# EAGLE design esquematico (EAGLE 9.6.2)
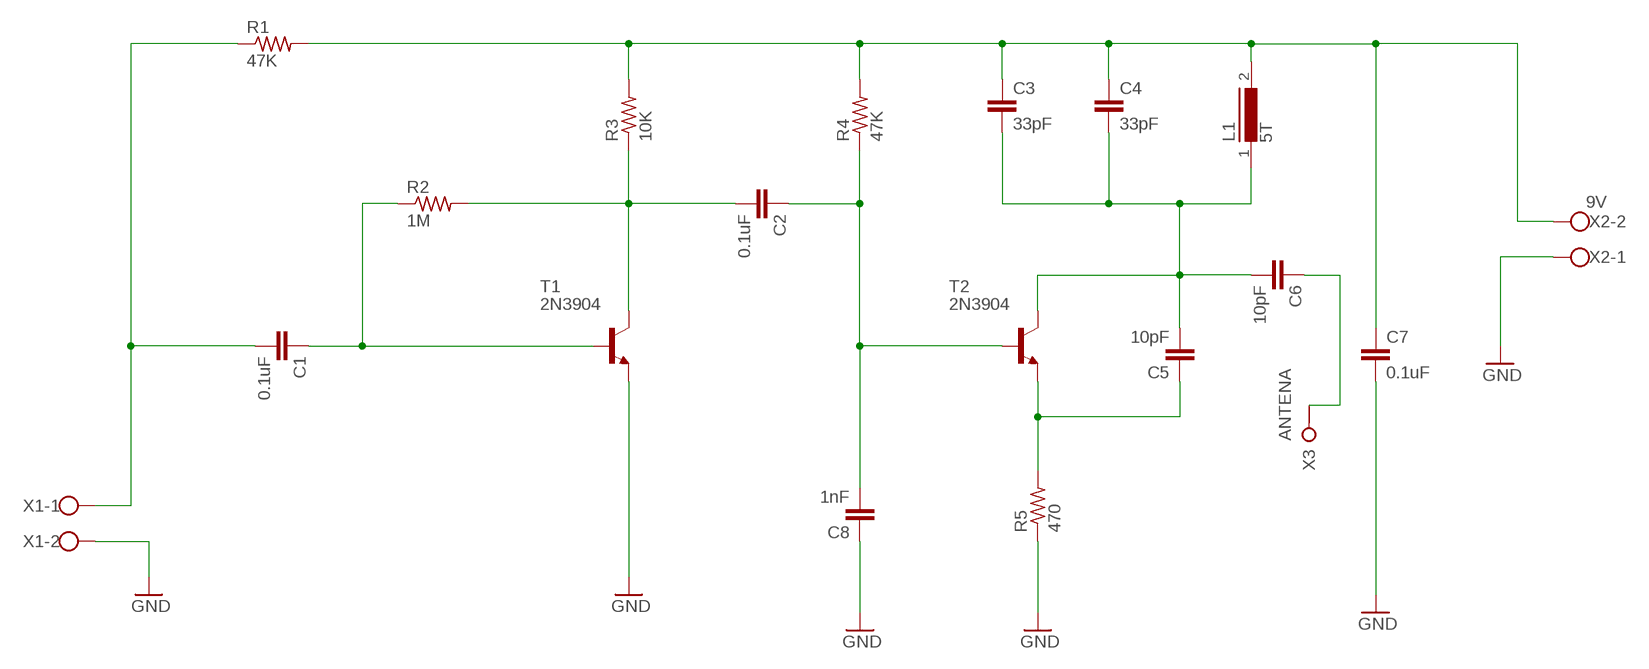
[diagram p0: schematic, sheet 1]

## Parts
C1  0.1uF  C-EU025-025X050  [C025-025X050]
C2  0.1uF  C-EU025-025X050  [C025-025X050]
C3  33pF  C-EU025-025X050  [C025-025X050]
C4  33pF  C-EU025-025X050  [C025-025X050]
C5  10pF  C-EU025-025X050  [C025-025X050]
C6  10pF  C-EU025-025X050  [C025-025X050]
C7  0.1uF  C-EU025-025X050  [C025-025X050]
C8  1nF  C-EU025-025X050  [C025-025X050]
L1  5T  A26GFC  [A26GFC]
R1  47K  R-US_0207/10  [0207/10]
R2  1M  R-US_0207/10  [0207/10]
R3  10K  R-US_0207/10  [0207/10]
R4  47K  R-US_0207/10  [0207/10]
R5  470  R-US_0207/10  [0207/10]
T1  2N3904  [TO92]
T2  2N3904  [TO92]
X1  W237-102  [W237-102]
X2  9V  W237-102  [W237-102]
X3  ANTENA  W236-1  [W236-1]

## Nets
GND: C7.2 C8.1 R5.1 T1.3(E) X1.2 X2.1
N$1: C1.2 R1.1 X1.1
N$2: C1.1 R2.1 T1.2(B)
N$3: C2.2 R2.2 R3.1 T1.1(C)
N$4: C3.1 C4.1 C7.1 L1.2 R1.2 R3.2 R4.2 X2.2
N$5: C2.1 C8.2 R4.1 T2.2(B)
N$6: C5.1 R5.2 T2.3(E)
N$7: C3.2 C4.2 C5.2 C6.2 L1.1 T2.1(C)
N$8: C6.1 X3.1(KL1)
Unconnected: X3.2(KL2)

## Library data of the parts
C1-C8 = rcl:C-EU: CAPACITOR, European symbol; SPICEPREFIX: C
L1 = inductors:A26GFC: INDUCTOR; SPICEPREFIX: L
R1-R5 = rcl:R-US_: RESISTOR, American symbol; SPICEPREFIX: R
T1 T2 = transistor:2N3904: NPN TRANSISTOR
X1 X2 = con-wago-500:W237-102: WAGO SCREW CLAMP; MPN: 237-102; OC_FARNELL: unknown; OC_NEWARK: 70K9898
X3 = con-wago-508:W236-1: WAGO SREW CLAMP; OC_FARNELL: unknown; OC_NEWARK: unknown

## Board
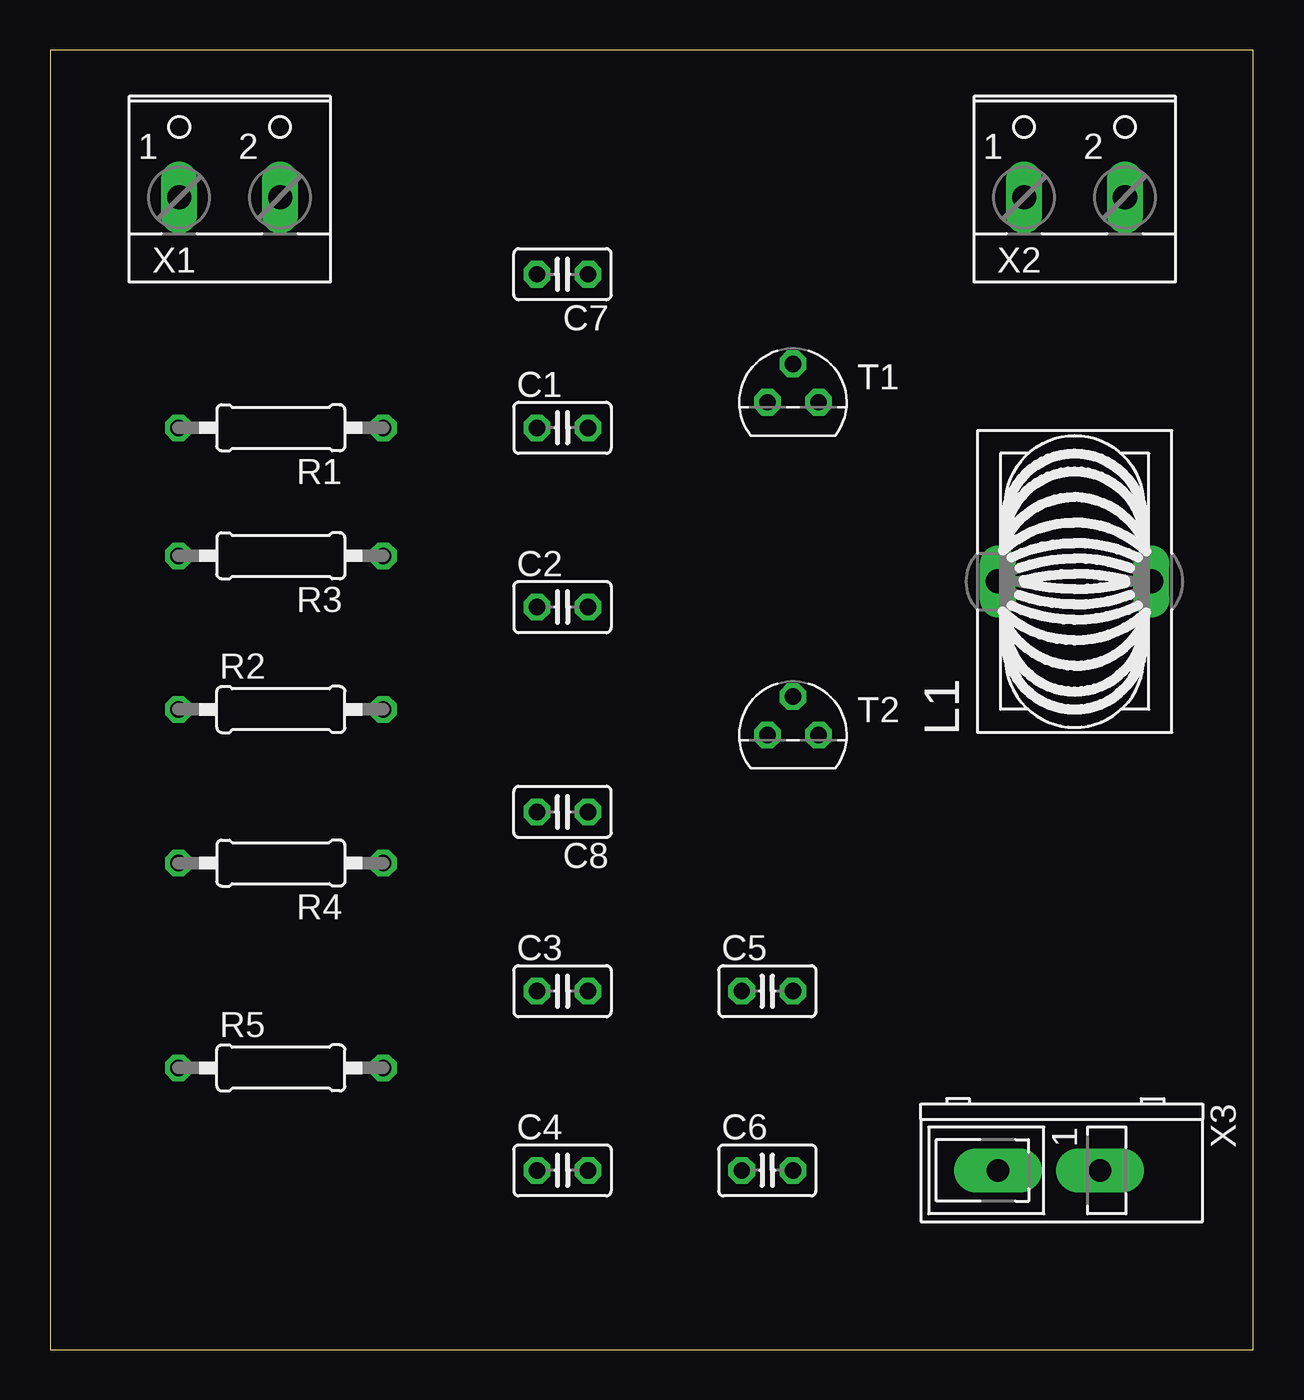
[diagram p1: board, top side]
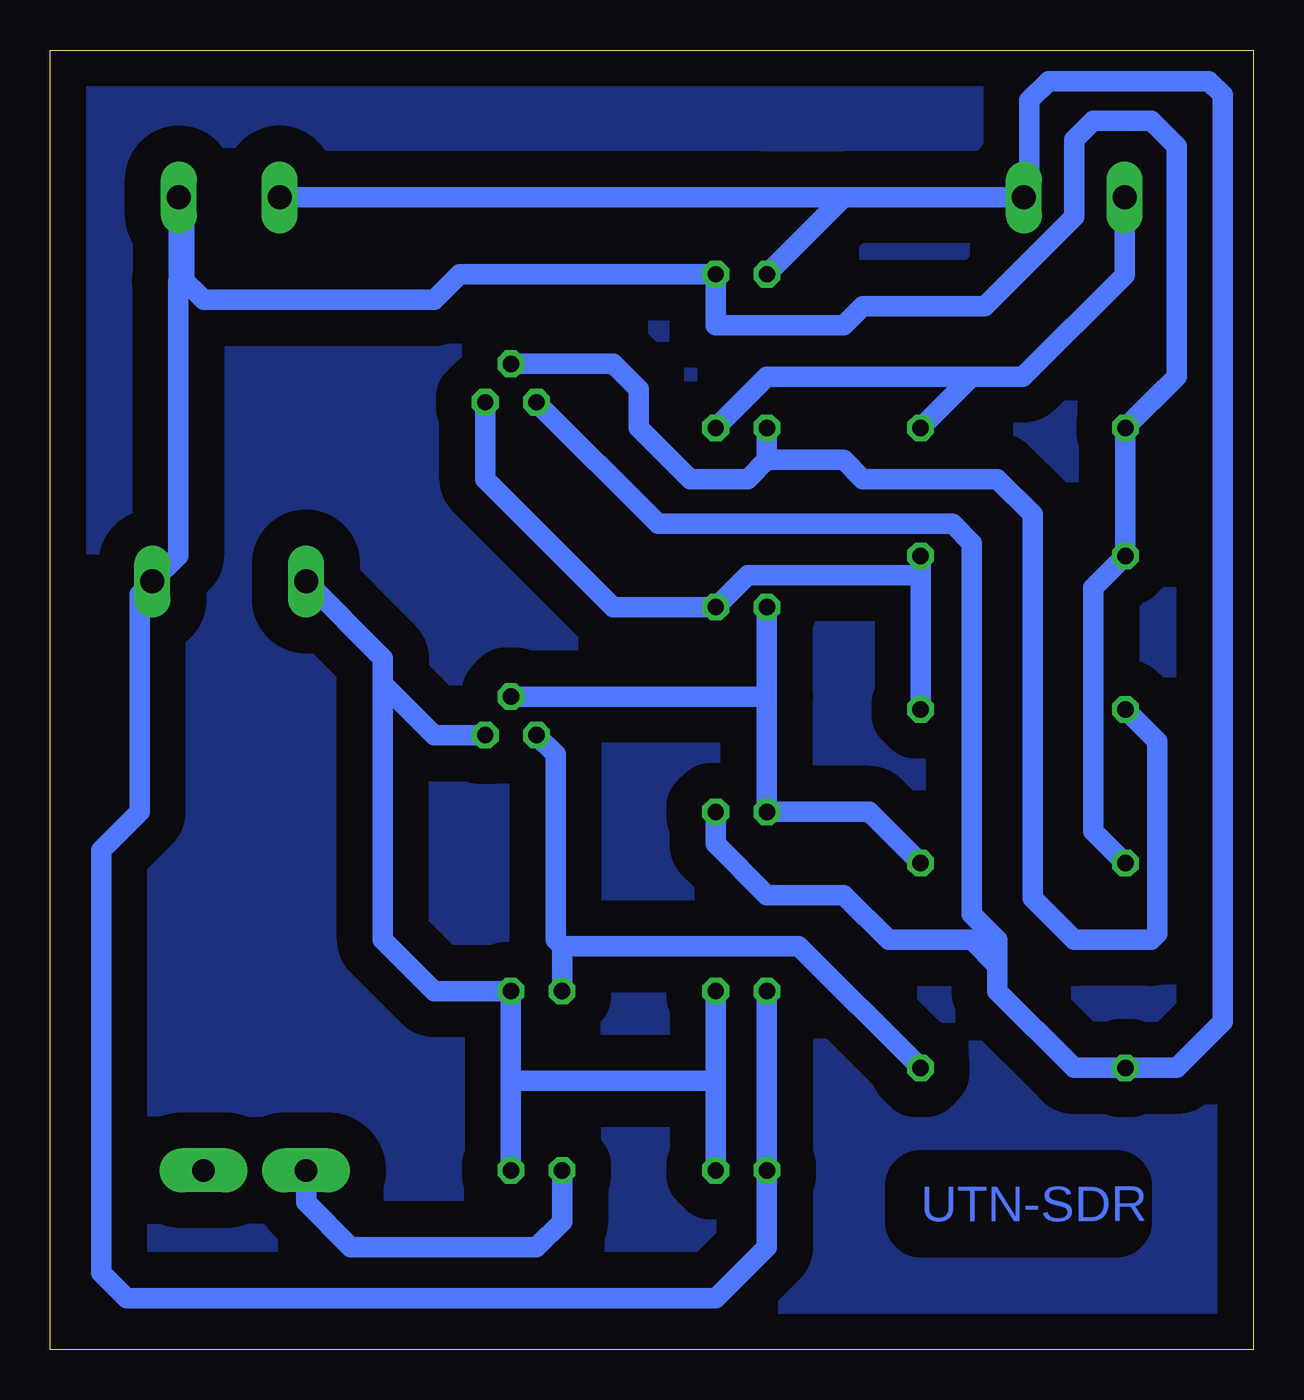
[diagram p2: board, bottom side, seen from below]

Size 59.67 x 64.44 mm. Coordinates in mm from the lower left corner, seen from the top.
Outline: 0,0 59.67,0 59.67,64.44 0,64.44 0,0
Copper layers (1*16): Top 0.035mm / dielectric 1.5mm / Bottom 0.035mm
Design rules "default *": minimum track width 40mil, minimum drill 0.35mm, track to track 15mil, track to pad 15mil, pad to pad 15mil, via to via 15mil, smd to smd 6mil, copper to edge 40mil, drill to drill 6mil, minimum pad ring 10mil, minimum via ring 8mil, stop-mask expansion 4mil, vias tented up to drill 0mil, thermal gap 10mil

### Footprints (pad centres in the part's own frame; a part is rotated, then mirrored left to right if it is on the bottom)
C025-025X050 = drill 0.813 octagon: 1 -1.27,0; 2 1.27,0
A26GFC = drill 1.194 long: 1 0,3.81; 2 0,-3.81
0207/10 = drill 0.813 octagon: 1 -5.08,0; 2 5.08,0
TO92 = drill 0.813 octagon: 1 1.27,0; 2 0,1.905; 3 -1.27,0
W237-102 = drill 1.194 long: 1 -2.5,-1.27; 2 2.5,-1.27
W236-1 = drill 1.118 pad 2.184 long: 1 0,-2.54; 2 0,2.54

### Placement (x,y rotation side)
C1  25.4,45.72 0 top
C2  25.4,36.83 0 top
C3  25.4,17.78 0 top
C4  25.4,8.89 0 top
C5  35.56,17.78 0 top
C6  35.56,8.89 0 top
C7  25.4,53.34 180 top
C8  25.4,26.67 180 top
L1  50.8,38.1 90 top
R1  11.43,45.72 180 top
R2  11.43,31.75 0 top
R3  11.43,39.37 180 top
R4  11.43,24.13 180 top
R5  11.43,13.97 0 top
T1  36.83,46.99 0 top
T2  36.83,30.48 0 top
X1  8.89,58.42 0 top
X2  50.8,58.42 0 top
X3  49.53,8.89 270 top

### Tracks (layer width: path | path; a pad name or v marks a point on that pad's centre or on a via)
GND
  Bottom 1.016: X2.1 26.67,57.15 24.45,57.15 20.32,57.15 | T1.3 29.53,40.96 14.92,40.96 13.97,40.01 13.97,21.59 12.7,20.32 12.7,19.05 | 12.7,19.05 12.7,17.78 8.89,13.97 R5.1 3.81,13.97 1.52,16.26 1.52,62.23 2.21,62.92 10.16,62.92 11.11,61.96 11.11,57.47 X1.2 20.32,57.15 | 12.7,19.05 13.97,20.32 18.1,20.32 20.32,22.54 24.13,22.54 26.67,25.08 C8.1 | 20.32,57.15 C7.2
N$1
  Bottom 1.016: 13.97,48.26 15.24,46.99 R1.1 | C1.2 25.08,47.31 24.13,48.26 13.97,48.26 | X1.1 6.39,53.3 11.43,48.26 13.97,48.26
N$2
  Bottom 1.016: R2.1 4.76,30.16 4.76,20.64 5.08,20.32 8.89,20.32 10.95,22.38 10.95,41.43 12.7,43.18 19.37,43.18 20.32,44.13 24.13,44.13 | C1.1 24.13,44.13 | T1.2 31.75,48.9 30.48,47.62 30.48,45.72 27.94,43.18 25.08,43.18 24.13,44.13
N$3
  Bottom 1.016: R3.1 16.51,38.42 | 16.51,38.42 R2.2 | 16.51,38.42 25.08,38.42 C2.2 31.75,36.83 38.1,43.18 T1.1
N$4
  Bottom 1.016: R4.2 7.94,25.72 7.94,37.78 R3.2 R1.2 | C3.1 C4.1 24.13,5.08 26.67,2.54 55.88,2.54 57.15,3.81 57.15,24.76 55.25,26.67 55.25,37.47 L1.2 53.34,39.37 53.34,53.02 53.02,53.34 53.02,57.15 X2.2 53.3,53.3 52.07,52.07 40.64,52.07 39.37,53.34 C7.1 26.67,50.8 20.32,50.8 19.37,51.75 13.33,51.75 8.89,56.2 8.89,60.01 7.94,60.96 5.08,60.96 3.81,59.69 3.81,48.26 R1.2 | 4.45,47.62 R1.2
N$5
  Bottom 1.016: 24.13,32.39 C8.2 19.05,26.67 R4.1 | 24.13,32.39 C2.1 | 24.13,32.39 T2.2
N$6
  Bottom 1.016: R5.2 22.54,20 34.29,20 | C5.1 34.29,20 | T2.3 34.61,29.53 34.61,20.32 34.29,20
N$7
  Bottom 1.016: C3.2 26.67,13.33 | 26.67,13.33 C4.2 | 36.83,13.33 C5.2 40.64,17.78 43.18,20.32 43.18,33.02 | 36.83,13.33 C6.2 | L1.1 43.18,34.29 43.18,33.02 | 36.83,13.33 26.67,13.33 | 43.18,33.02 40.64,30.48 T2.1
N$8
  Bottom 1.016: X3.1 46.99,7.3 44.77,5.08 35.56,5.08 34.29,6.35 C6.1
N$9
  pour Bottom (isolate 1.778): 0,64.77 59.69,64.77 59.69,0 0,0

### Text on the board
Bottom: UTN-SDR